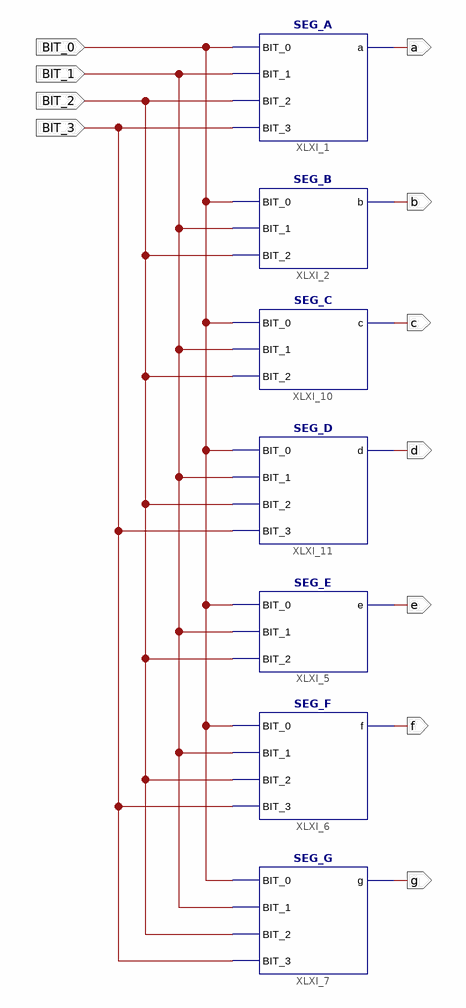
[diagram p0: schematic sheet 1]
// Xilinx ISE schematic BCD2SEG.sch (spartan6) as structural Verilog: 7 symbols, 11 ports
module BCD2SEG (
  input  BIT_0,
  input  BIT_1,
  input  BIT_2,
  input  BIT_3,
  output a,
  output c,
  output d,
  output e,
  output f,
  output g,
  output b
);

  SEG_A XLXI_1 (.BIT_0(BIT_0), .BIT_1(BIT_1), .BIT_2(BIT_2), .BIT_3(BIT_3), .a(a));
  SEG_B XLXI_2 (.BIT_0(BIT_0), .BIT_1(BIT_1), .BIT_2(BIT_2), .b(b));
  SEG_E XLXI_5 (.BIT_0(BIT_0), .BIT_1(BIT_1), .BIT_2(BIT_2), .e(e));
  SEG_F XLXI_6 (.BIT_0(BIT_0), .BIT_1(BIT_1), .BIT_2(BIT_2), .BIT_3(BIT_3), .f(f));
  SEG_G XLXI_7 (.BIT_0(BIT_0), .BIT_1(BIT_1), .BIT_2(BIT_2), .BIT_3(BIT_3), .g(g));
  SEG_C XLXI_10 (.BIT_0(BIT_0), .BIT_2(BIT_2), .BIT_1(BIT_1), .c(c));
  SEG_D XLXI_11 (.BIT_3(BIT_3), .BIT_0(BIT_0), .BIT_1(BIT_1), .BIT_2(BIT_2), .d(d));
endmodule
